# EAGLE design ProjetoFinal (EAGLE 9.6.2)
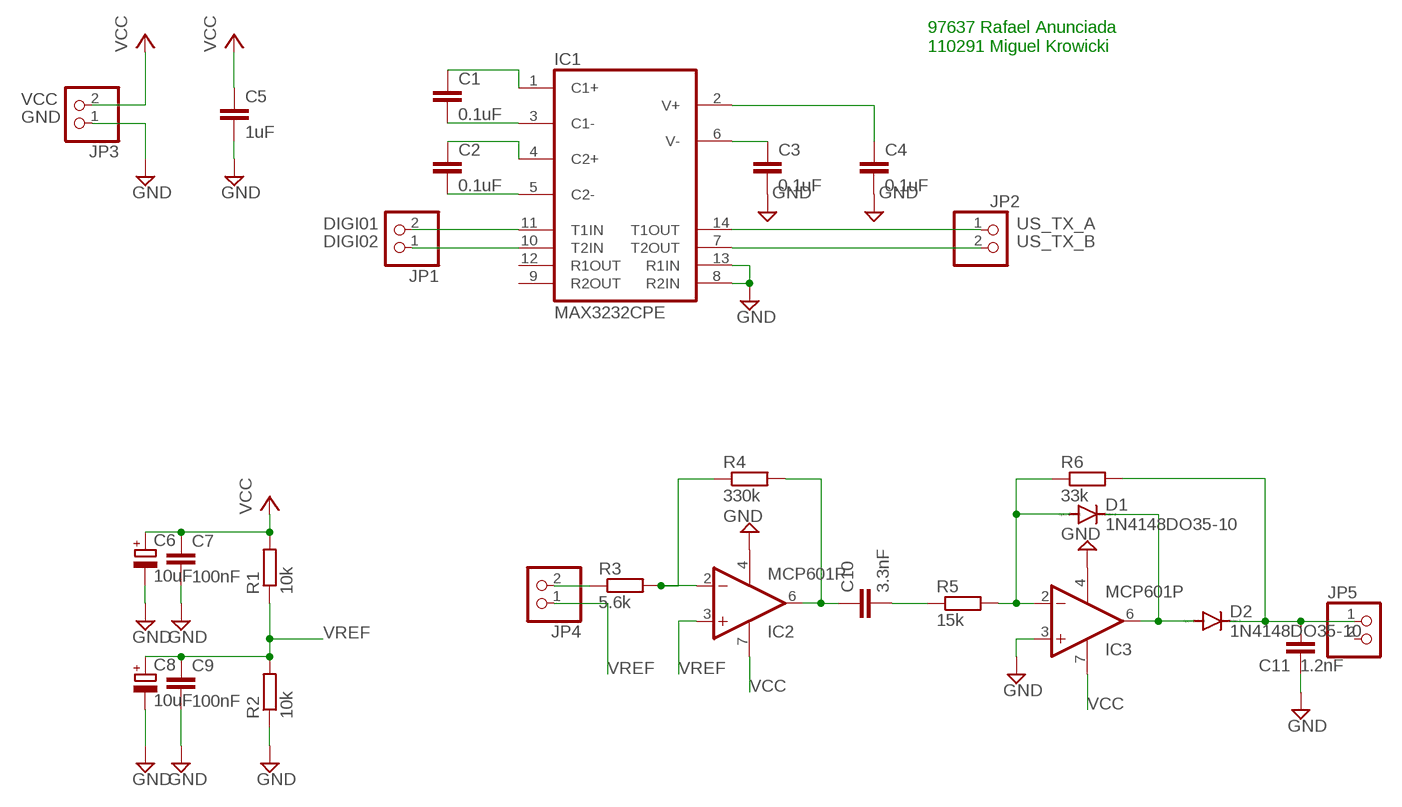
[diagram p0: schematic, sheet 1]

## Parts
C1  0.1uF  C-EU025-025X050  [C025-025X050]
C2  0.1uF  C-EU025-025X050  [C025-025X050]
C3  0.1uF  C-EU025-025X050  [C025-025X050]
C4  0.1uF  C-EU025-025X050  [C025-025X050]
C5  1uF  C-EU025-025X050  [C025-025X050]
C6  10uF  CPOL-EUE2.5-6  [E2,5-6]
C7  100nF  C-EU025-025X050  [C025-025X050]
C8  10uF  CPOL-EUE2.5-6  [E2,5-6]
C9  100nF  C-EU025-025X050  [C025-025X050]
C10  3.3nF  C-EU025-025X050  [C025-025X050]
C11  1.2nF  C-EU025-025X050  [C025-025X050]
D1  1N4148DO35-10  [DO35-10]
D2  1N4148DO35-10  [DO35-10]
IC1  MAX3232CPE  [DIL16]
IC2  MCP601P  [DIL08]
IC3  MCP601P  [DIL08]
JP1  PINHD-1X2  [1X02]
JP2  PINHD-1X2  [1X02]
JP3  PINHD-1X2  [1X02]
JP4  PINHD-1X2  [1X02]
JP5  PINHD-1X2  [1X02]
R1  10k  R-EU_0207/10  [0207/10]
R2  10k  R-EU_0207/10  [0207/10]
R3  5.6k  R-EU_0207/10  [0207/10]
R4  330k  R-EU_0207/10  [0207/10]
R5  15k  R-EU_0207/10  [0207/10]
R6  33k  R-EU_0207/10  [0207/10]

## Nets
DIGI01: IC1.11(T1IN) JP1.2
DIGI02: IC1.10(T2IN) JP1.1
GND: C3.2 C4.2 C5.2 C6.- C7.2 C8.- C9.2 C11.1 IC1.8(R2IN) IC1.13(R1IN) IC2.4(V-) IC3.3(+IN) IC3.4(V-) JP3.1 R2.1
N$1: C1.2 IC1.3(C1-)
N$2: C1.1 IC1.1(C1+)
N$3: C2.2 IC1.5(C2-)
N$4: C2.1 IC1.4(C2+)
N$5: C3.1 IC1.6(V-)
N$6: C4.1 IC1.2(V+)
N$7: JP4.2 R3.1
N$9: C10.1 IC2.6(OUT) R4.2
N$10: C10.2 R5.1
N$11: D1.A IC3.2(-IN) R5.2 R6.1
N$12: D1.C D2.A IC3.6(OUT)
N$13: C11.2 D2.C JP5.1 R6.2
N$14: IC2.2(-IN) R3.2 R4.1
US_TX_A: IC1.14(T1OUT) JP2.1
US_TX_B: IC1.7(T2OUT) JP2.2
VCC: C5.1 C6.+ C7.1 IC2.7(V+) IC3.7(V+) JP3.2 R1.2
VREF: C8.+ C9.1 IC2.3(+IN) JP4.1 R1.1 R2.2
Unconnected: IC1.9(R2OUT) IC1.12(R1OUT) JP5.2

## Notes on the sheet
- 97637 Rafael Anunciada
  110291 Miguel Krowicki

## Power pins joined to a net without a drawn wire
GND: IC1.15(GND)
VCC: IC1.16(VCC)

## Library data of the parts
C1-C5 C7 C9-C11 = rcl:C-EU: CAPACITOR, European symbol; SPICEPREFIX: C
C6 C8 = rcl:CPOL-EU: POLARIZED CAPACITOR, European symbol; SPICEPREFIX: C
D1 D2 = diode:1N4148: DIODE high speed (Philips)
IC1 = maxim:MAX3232*: True RS-232 Transceivers 3.0V to 5.5V, Low-Power up to 1Mbps, Using Four 0.1µF External Capacitors Source: http://pdfserv.maxim-ic.com/en/ds/MAX3222-MAX3241.pdf; MF: MAXIM; MPN: MAX3232CPE+; OC_FARNELL: 9724494; OC_NEWARK: 68K4626
IC2 IC3 = linear:MCP601: Single Op Amp 2.7V to 6.0V Single Supply CMOS Source: http://ww1.microchip.com/downloads/en/DeviceDoc/21314g.pdf
JP1-JP5 = pinhead:PINHD-1X2: PIN HEADER
R1-R6 = rcl:R-EU_: RESISTOR, European symbol; SPICEPREFIX: R

## Board
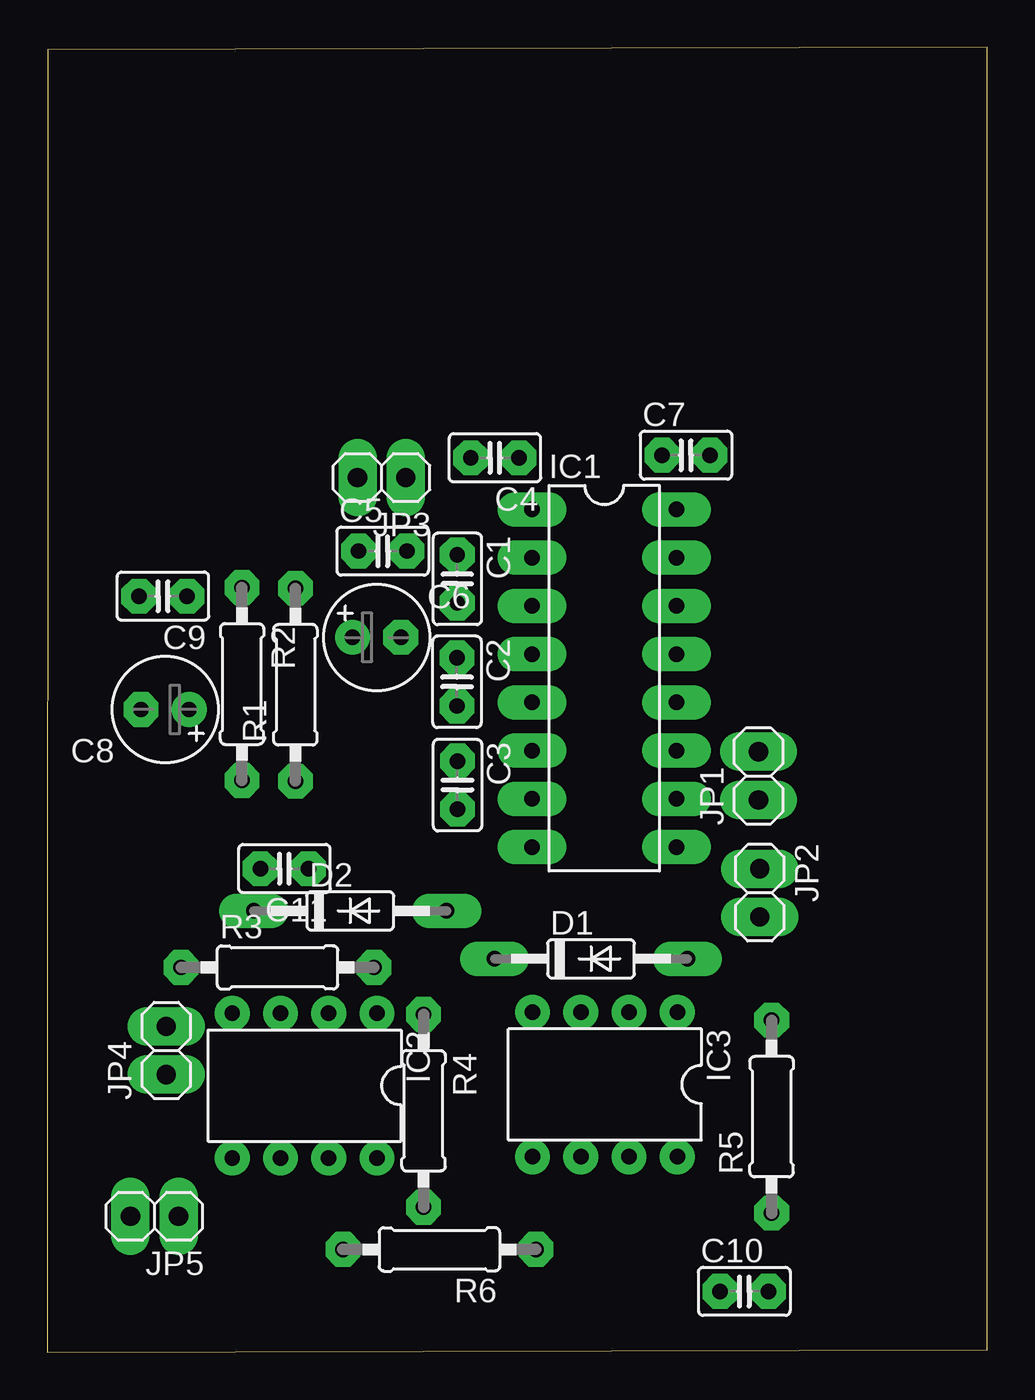
[diagram p1: board, top side]
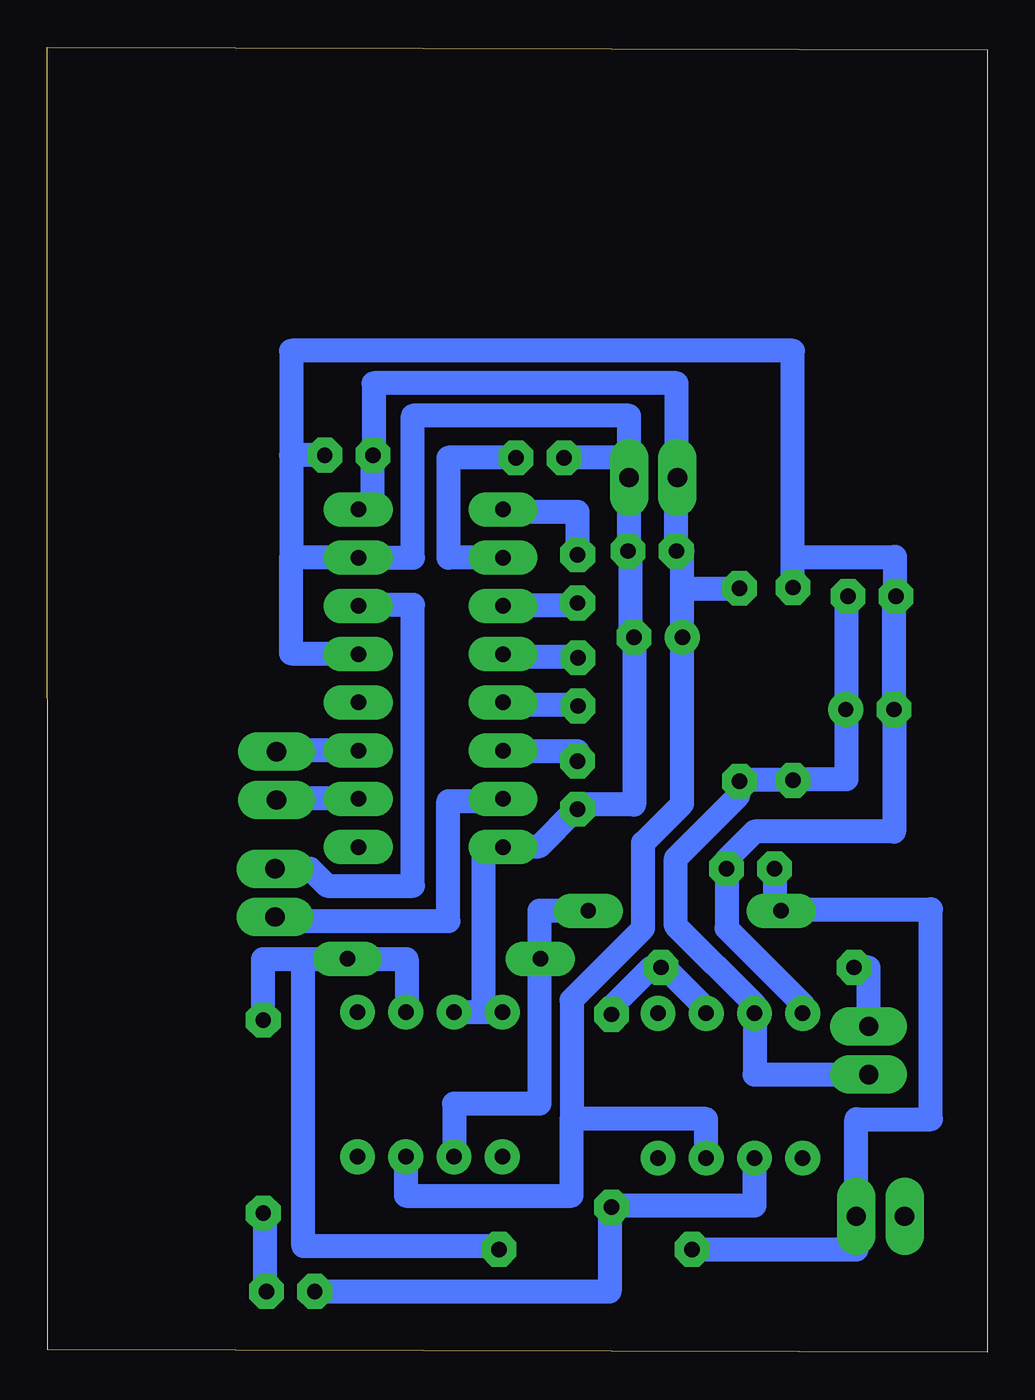
[diagram p2: board, bottom side, seen from below]

Size 49.5 x 68.73 mm. Coordinates in mm from the lower left corner, seen from the top.
Outline: 0,0 49.49,0.12 49.5,68.73 0.01,68.61 0,0
Copper layers (1*16): Top 0.035mm / dielectric 1.5mm / Bottom 0.035mm
Design rules "LabE": minimum track width 50mil, minimum drill 0.8mm, track to track 16mil, track to pad 16mil, pad to pad 16mil, via to via 16mil, smd to smd 16mil, copper to edge 0mil, drill to drill 16mil, minimum pad ring 20mil, minimum via ring 20mil, stop-mask expansion 4mil, vias tented up to drill 0mil, thermal gap 10mil

### Footprints (pad centres in the part's own frame; a part is rotated, then mirrored left to right if it is on the bottom)
C025-025X050 = drill 0.813 octagon: 1 -1.27,0; 2 1.27,0
E2,5-6 = drill 0.813 pad 1.6: + -1.27,0 | drill 0.813 pad 1.6 octagon: - 1.27,0
DO35-10 = drill 0.813 long: A 5.08,0; C -5.08,0
DIL16 = drill 0.813 long: 1 -8.89,-3.81; 2 -6.35,-3.81; 3 -3.81,-3.81; 4 -1.27,-3.81; 5 1.27,-3.81; 6 3.81,-3.81; 7 6.35,-3.81; 8 8.89,-3.81; 9 8.89,3.81; 10 6.35,3.81; 11 3.81,3.81; 12 1.27,3.81; 13 -1.27,3.81; 14 -3.81,3.81; 15 -6.35,3.81; 16 -8.89,3.81
DIL08 = drill 0.813 pad 1.27: 1 -3.81,-3.81; 2 -1.27,-3.81; 3 1.27,-3.81; 4 3.81,-3.81; 5 3.81,3.81; 6 1.27,3.81; 7 -1.27,3.81; 8 -3.81,3.81
1X02 = drill 1.016 long: 1 -1.27,0; 2 1.27,0
0207/10 = drill 0.813 octagon: 1 -5.08,0; 2 5.08,0

### Placement (x,y rotation side)
C1  21.58,40.73 270 top
C2  21.56,35.31 270 top
C3  21.59,29.87 270 top
C4  23.56,47.11 180 top
C5  17.66,42.2 0 top
C6  17.34,37.65 0 top
C7  33.63,47.25 0 top
C8  6.19,33.85 180 top
C9  6.08,39.82 180 top
C10  36.7,3.2 0 top
C11  12.48,25.47 180 top
D1  28.63,20.72 0 top
D2  15.94,23.24 0 top
IC1  29.32,35.5 270 top
IC2  13.54,14.03 180 top
IC3  29.36,14.1 180 top
JP1  37.44,30.36 90 top
JP2  37.51,24.19 270 top
JP3  17.6,46.07 180 top
JP4  6.26,15.89 90 top
JP5  5.64,7.15 180 top
R1  13.06,35.15 90 top
R2  10.24,35.19 270 top
R3  12.11,20.26 0 top
R4  19.81,12.71 270 top
R5  38.14,12.4 90 top
R6  20.64,5.41 180 top

### Tracks (layer width: path | path; a pad name or v marks a point on that pad's centre or on a via)
DIGI01
  Bottom 1.27: IC1.11 33.29,31.73 37.42,31.73 JP1.2
DIGI02
  Bottom 1.27: IC1.10 33.29,29.19 37.42,29.19 JP1.1
GND
  Bottom 1.27: 21.7,28.55 23.6,26.65 25.51,26.65 IC1.8 25.55,26.64 26.51,26.64 26.51,17.91 IC3.3 28.05,17.91 25.67,17.91 IC3.4 | 21.7,28.55 21.41,28.84 18.61,28.84 C6.- 18.8,37.84 18.8,42.2 C5.2 18.87,42.2 JP3.1 | 21.7,28.55 C3.2 | IC1.13 33.29,36.81 36.68,36.81 36.68,41.85 | IC2.4 9.73,18.33 13.73,22.33 13.73,25.45 C11.1 13.75,25.94 12.26,27.43 4.91,27.43 C8.- 4.93,33.86 4.93,39.7 C9.2 4.87,39.89 4.87,41.89 10.24,41.89 R2.1 10.24,52.75 36.68,52.75 36.68,47.25 | 36.68,47.25 36.68,41.85 | 36.68,41.85 IC1.15 30.25,41.85 30.25,49.33 18.87,49.33 JP3.1 | C7.2 36.68,47.25 | 36.68,47.25 | C4.2 18.86,47.11 18.86,46.08 JP3.1
N$1
  Bottom 1.27: C1.2 21.7,39.35 25.51,39.35 IC1.3
N$2
  Bottom 1.27: C1.1 21.58,44.27 25.51,44.27 IC1.1
N$3
  Bottom 1.27: C2.2 21.7,34.11 25.51,34.11 IC1.5
N$4
  Bottom 1.27: C2.1 21.7,36.65 25.51,36.65 IC1.4
N$5
  Bottom 1.27: C3.1 21.59,31.66 25.51,31.66 IC1.6
N$6
  Bottom 1.27: C4.1 28.39,47.11 28.39,41.85 IC1.2
N$7
  Bottom 1.27: JP4.2 6.25,20.26 R3.1
N$9
  Bottom 1.27: C10.1 19.9,3.2 19.9,7.53 R4.2 19.71,7.72 12.27,7.72 IC2.6
N$10
  Bottom 1.27: C10.2 38.05,3.28 38.05,7.28 R5.1
N$11
  Bottom 1.27: IC3.2 30.58,17.95 30.58,20.71 33.69,20.71 | 33.69,20.71 D1.A | R6.1 25.9,5.59 36.03,5.59 36.03,20.71 | 36.03,20.71 38.14,20.71 R5.2 | 36.03,20.71 33.69,20.71
N$12
  Bottom 1.27: D2.A 23.59,23.24 23.59,20.77 D1.C 23.59,20.67 23.59,13.08 28.09,13.08 IC3.6
N$13
  Bottom 1.27: C11.2 11.21,23.59 D2.C 10.78,23.33 2.98,23.33 2.98,12.26 6.91,12.26 JP5.1 6.91,5.41 R6.2
N$14
  Bottom 1.27: R4.1 19.8,18.16 17.7,20.26 R3.2 17,20.26 14.81,18.07 IC2.2
US_TX_A
  Bottom 1.27: JP2.1 35.67,25.46 34.76,24.56 30.26,24.56 30.26,39.35 33.08,39.35 IC1.14
US_TX_B
  Bottom 1.27: IC1.7 25.67,29.03 28.39,29.03 28.39,22.7 37.29,22.7 JP2.2
VCC
  Bottom 1.27: 21.9,12.28 21.9,18.55 18.13,22.33 18.13,26.83 16.07,28.88 C6.+ 16.07,40.23 | IC1.16 32.41,44.39 32.41,47.2 C7.1 32.32,47.29 32.32,51.03 16.37,51.03 16.37,46.07 JP3.2 16.39,46.07 C5.1 16.07,42.2 16.07,40.23 | IC2.7 14.81,12.28 21.9,12.28 | IC3.7 30.63,8.23 21.9,8.23 21.9,12.28 | 16.07,40.23 R1.2
VREF
  Bottom 1.27: C9.1 7.43,39.74 7.43,33.88 C8.+ 7.42,33.81 7.42,30.19 10.17,30.19 R2.2 10.27,30.14 12.97,30.14 R1.1 13.12,30.01 13.12,29.3 16.41,26.02 16.41,22.46 12.23,18.28 12.23,17.89 IC2.3 12.27,14.62 JP4.1